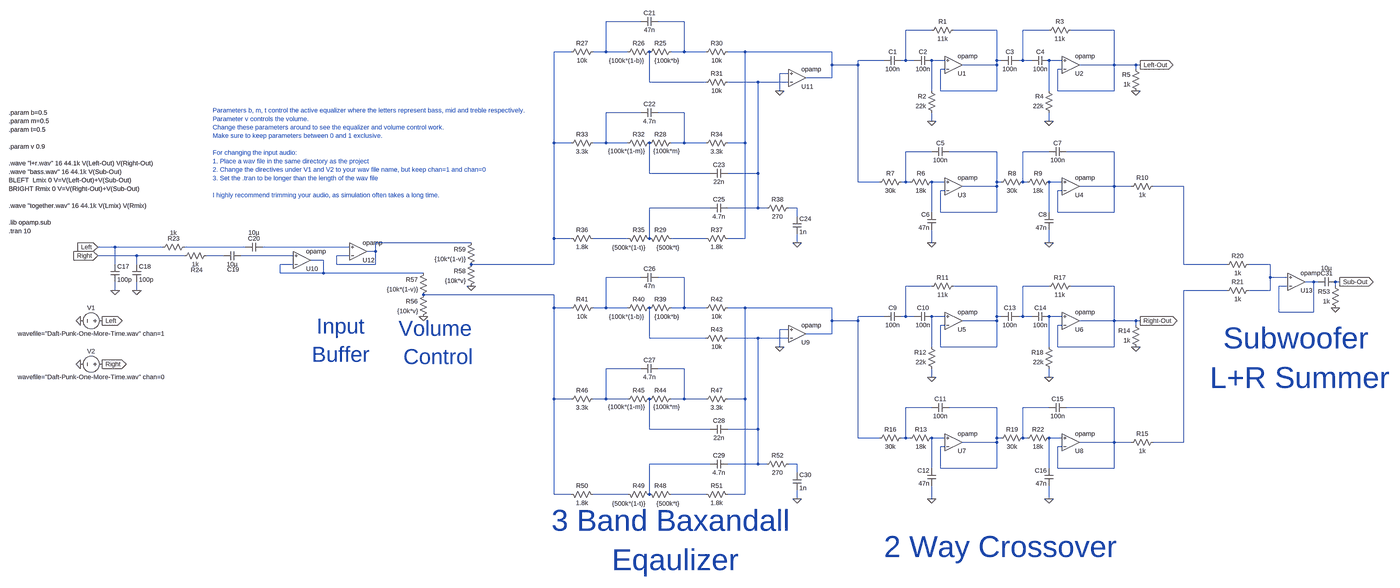
[diagram p0: schematic SoundSystemSpice.asc, whole sheet]
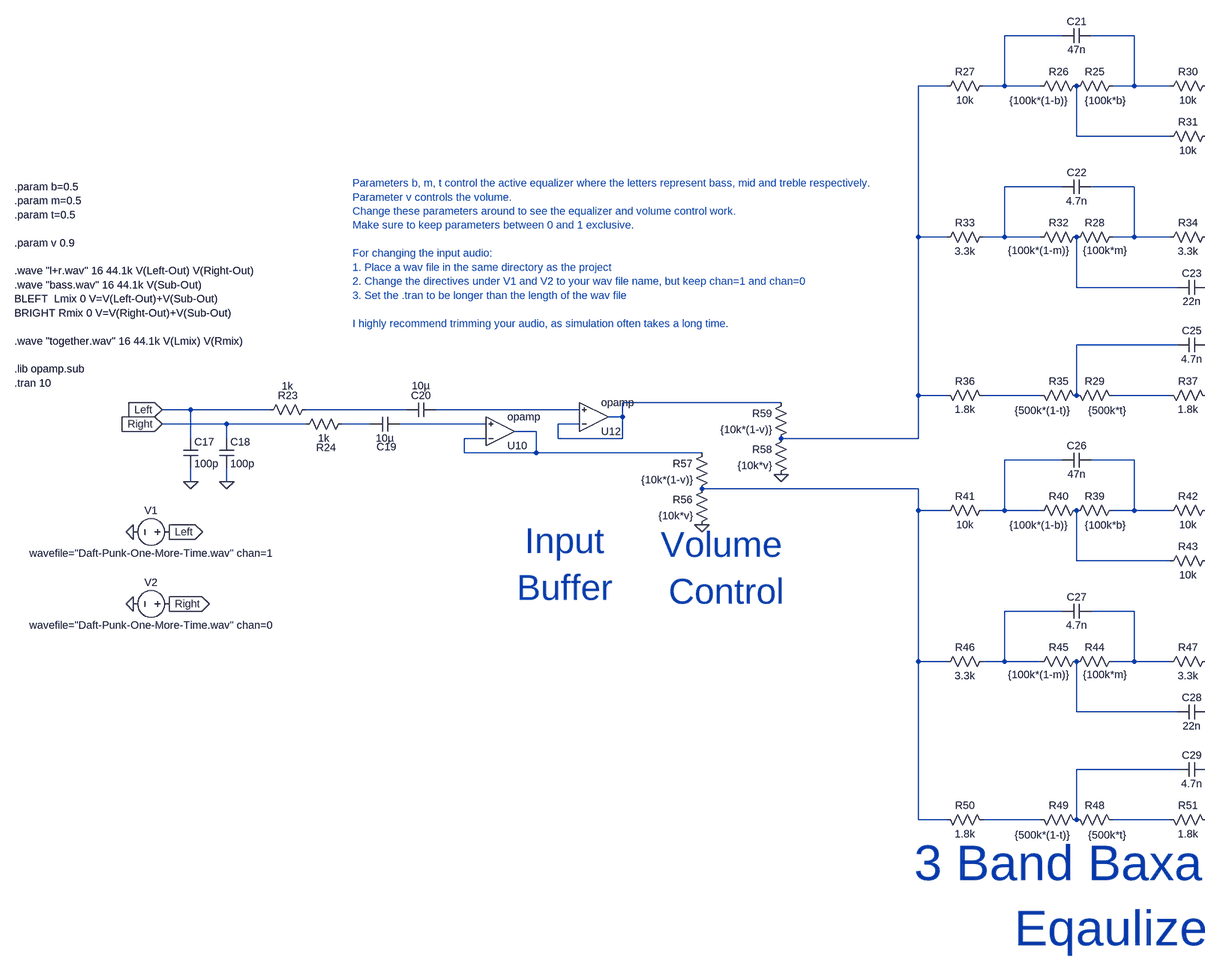
[diagram p1: schematic SoundSystemSpice.asc, part, row 1 of 1, column 1 of 2]
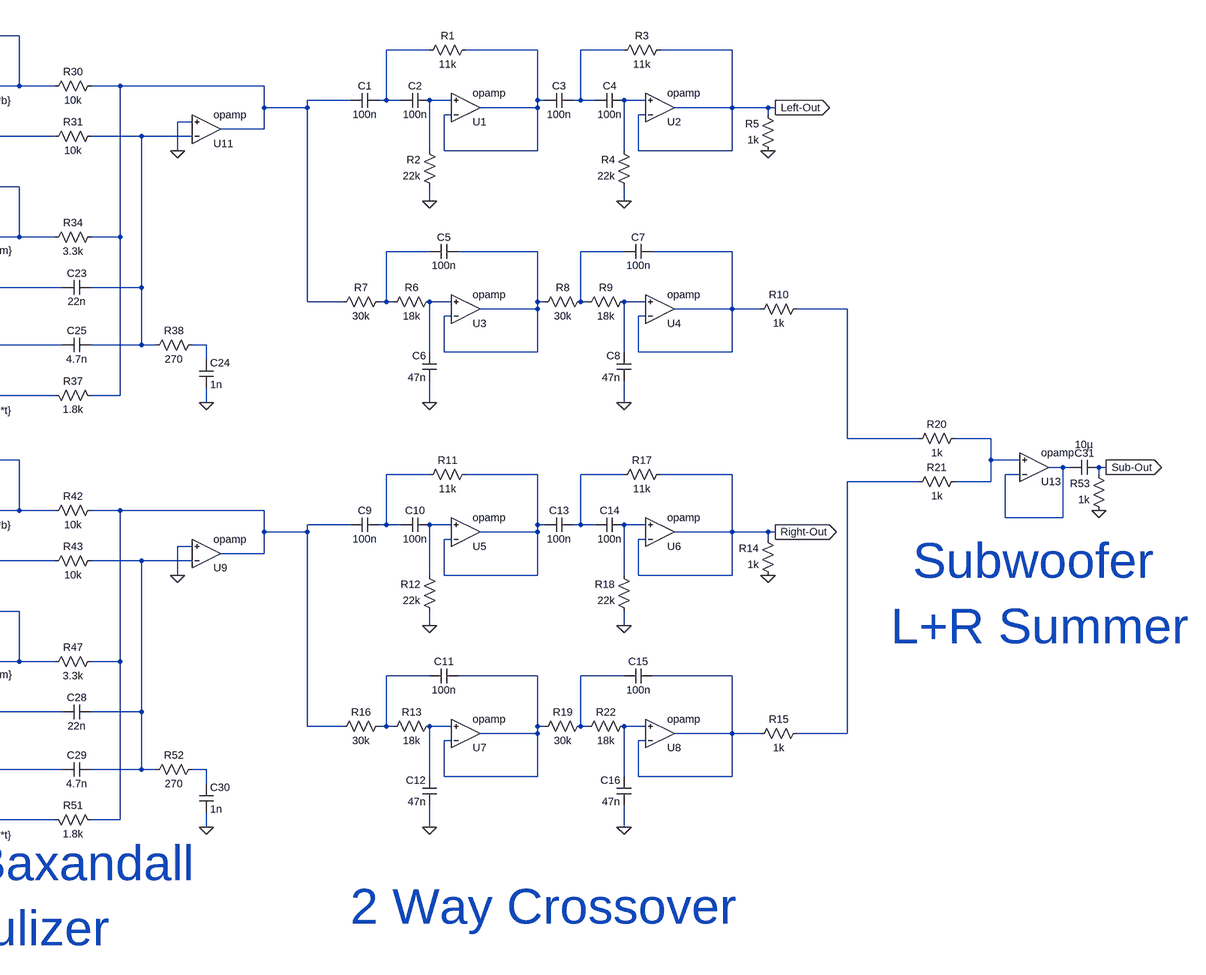
[diagram p2: schematic SoundSystemSpice.asc, part, row 1 of 1, column 2 of 2]
SoundSystemSpice.asc, the LTspice schematic file:
Version 4.1
SHEET 1 2132 1684
WIRE -864 -1056 -992 -1056
WIRE -704 -1056 -800 -1056
WIRE 208 -1024 112 -1024
WIRE 448 -1024 288 -1024
WIRE 640 -1024 544 -1024
WIRE 880 -1024 720 -1024
WIRE -1120 -944 -1184 -944
WIRE -992 -944 -992 -1056
WIRE -992 -944 -1040 -944
WIRE -912 -944 -992 -944
WIRE -704 -944 -704 -1056
WIRE -704 -944 -752 -944
WIRE -624 -944 -704 -944
WIRE -480 -944 -544 -944
WIRE -160 -944 -480 -944
WIRE 32 -912 -64 -912
WIRE 112 -912 112 -1024
WIRE 112 -912 96 -912
WIRE 144 -912 112 -912
WIRE 256 -912 208 -912
WIRE 448 -912 448 -1024
WIRE 464 -912 448 -912
WIRE 544 -912 544 -1024
WIRE 544 -912 528 -912
WIRE 576 -912 544 -912
WIRE 688 -912 640 -912
WIRE -160 -896 -160 -944
WIRE -64 -896 -64 -912
WIRE -64 -896 -160 -896
WIRE 448 -896 448 -912
WIRE 448 -896 320 -896
WIRE 880 -896 880 -1024
WIRE 880 -896 752 -896
WIRE 960 -896 880 -896
WIRE 976 -896 960 -896
WIRE 256 -880 240 -880
WIRE 688 -880 672 -880
WIRE 960 -880 960 -896
WIRE -320 -864 -352 -864
WIRE -160 -848 -160 -896
WIRE -160 -848 -256 -848
WIRE -832 -832 -832 -944
WIRE -624 -832 -832 -832
WIRE -432 -832 -544 -832
WIRE -320 -832 -432 -832
WIRE -352 -800 -352 -864
WIRE 208 -800 208 -912
WIRE 240 -800 240 -880
WIRE 448 -800 448 -896
WIRE 448 -800 240 -800
WIRE 640 -800 640 -912
WIRE 672 -800 672 -880
WIRE 880 -800 880 -896
WIRE 880 -800 672 -800
WIRE -864 -720 -992 -720
WIRE -704 -720 -800 -720
WIRE 208 -688 208 -720
WIRE 640 -688 640 -720
WIRE -1184 -608 -1184 -944
WIRE -1120 -608 -1184 -608
WIRE -992 -608 -992 -720
WIRE -992 -608 -1040 -608
WIRE -912 -608 -992 -608
WIRE -704 -608 -704 -720
WIRE -704 -608 -752 -608
WIRE -624 -608 -704 -608
WIRE -480 -608 -480 -944
WIRE -480 -608 -544 -608
WIRE 208 -576 112 -576
WIRE 448 -576 272 -576
WIRE 640 -576 544 -576
WIRE 880 -576 704 -576
WIRE -832 -496 -832 -608
WIRE -608 -496 -832 -496
WIRE -432 -496 -432 -832
WIRE -432 -496 -544 -496
WIRE -64 -464 -64 -896
WIRE 16 -464 -64 -464
WIRE 112 -464 112 -576
WIRE 112 -464 96 -464
WIRE 128 -464 112 -464
WIRE 256 -464 208 -464
WIRE 448 -464 448 -576
WIRE 464 -464 448 -464
WIRE 544 -464 544 -576
WIRE 560 -464 544 -464
WIRE 688 -464 640 -464
WIRE 448 -448 448 -464
WIRE 448 -448 320 -448
WIRE 880 -448 880 -576
WIRE 880 -448 752 -448
WIRE 944 -448 880 -448
WIRE 1136 -448 1024 -448
WIRE 256 -432 240 -432
WIRE 688 -432 672 -432
WIRE -608 -368 -832 -368
WIRE -432 -368 -432 -496
WIRE -432 -368 -544 -368
WIRE -400 -368 -432 -368
WIRE -288 -368 -320 -368
WIRE 208 -352 208 -464
WIRE 240 -352 240 -432
WIRE 448 -352 448 -448
WIRE 448 -352 240 -352
WIRE 640 -352 640 -464
WIRE 672 -352 672 -432
WIRE 880 -352 880 -448
WIRE 880 -352 672 -352
WIRE -288 -336 -288 -368
WIRE -1184 -256 -1184 -608
WIRE -1120 -256 -1184 -256
WIRE -912 -256 -1040 -256
WIRE -832 -256 -832 -368
WIRE -624 -256 -752 -256
WIRE -480 -256 -480 -608
WIRE -480 -256 -544 -256
WIRE -1584 -240 -1936 -240
WIRE -288 -240 -288 -272
WIRE 208 -240 208 -288
WIRE 640 -240 640 -288
WIRE -2896 -224 -2960 -224
WIRE -2720 -224 -2896 -224
WIRE -2416 -224 -2640 -224
WIRE -2032 -224 -2352 -224
WIRE -1936 -208 -1936 -240
WIRE -1936 -208 -1968 -208
WIRE -2816 -192 -2960 -192
WIRE -2640 -192 -2816 -192
WIRE -2496 -192 -2560 -192
WIRE -2240 -192 -2432 -192
WIRE -2032 -192 -2080 -192
WIRE -2128 -176 -2176 -176
WIRE -2896 -160 -2896 -224
WIRE -2816 -160 -2816 -192
WIRE -2240 -160 -2288 -160
WIRE -2080 -160 -2080 -192
WIRE -1936 -160 -1936 -208
WIRE -1936 -160 -2080 -160
WIRE -1184 -160 -1184 -256
WIRE -1184 -160 -1584 -160
WIRE 1136 -160 1136 -448
WIRE 1312 -160 1136 -160
WIRE 1472 -160 1392 -160
WIRE -2288 -128 -2288 -160
WIRE -2128 -128 -2128 -176
WIRE -2128 -128 -2288 -128
WIRE -1760 -128 -2128 -128
WIRE -864 -112 -992 -112
WIRE -704 -112 -800 -112
WIRE 1472 -112 1472 -160
WIRE 1536 -112 1472 -112
WIRE 1632 -96 1600 -96
WIRE 1648 -96 1632 -96
WIRE 1728 -96 1712 -96
WIRE 208 -80 112 -80
WIRE 448 -80 288 -80
WIRE 640 -80 544 -80
WIRE 880 -80 720 -80
WIRE 1536 -80 1504 -80
WIRE 1712 -80 1712 -96
WIRE -2896 -64 -2896 -96
WIRE -2816 -64 -2816 -96
WIRE 1312 -64 1136 -64
WIRE 1472 -64 1472 -112
WIRE 1472 -64 1392 -64
WIRE -1184 -48 -1760 -48
WIRE -1184 0 -1184 -48
WIRE -1120 0 -1184 0
WIRE -992 0 -992 -112
WIRE -992 0 -1040 0
WIRE -912 0 -992 0
WIRE -704 0 -704 -112
WIRE -704 0 -752 0
WIRE -624 0 -704 0
WIRE -480 0 -544 0
WIRE -160 0 -480 0
WIRE 1504 16 1504 -80
WIRE 1632 16 1632 -96
WIRE 1632 16 1504 16
WIRE 32 32 -64 32
WIRE 112 32 112 -80
WIRE 112 32 96 32
WIRE 144 32 112 32
WIRE 256 32 208 32
WIRE 448 32 448 -80
WIRE 464 32 448 32
WIRE 544 32 544 -80
WIRE 544 32 528 32
WIRE 576 32 544 32
WIRE 688 32 640 32
WIRE -160 48 -160 0
WIRE -64 48 -64 32
WIRE -64 48 -160 48
WIRE 448 48 448 32
WIRE 448 48 320 48
WIRE 880 48 880 -80
WIRE 880 48 752 48
WIRE 960 48 880 48
WIRE 976 48 960 48
WIRE 256 64 240 64
WIRE 688 64 672 64
WIRE 960 64 960 48
WIRE -320 80 -352 80
WIRE -160 96 -160 48
WIRE -160 96 -256 96
WIRE -832 112 -832 0
WIRE -624 112 -832 112
WIRE -432 112 -544 112
WIRE -320 112 -432 112
WIRE -352 144 -352 80
WIRE 208 144 208 32
WIRE 240 144 240 64
WIRE 448 144 448 48
WIRE 448 144 240 144
WIRE 640 144 640 32
WIRE 672 144 672 64
WIRE 880 144 880 48
WIRE 880 144 672 144
WIRE -864 224 -992 224
WIRE -704 224 -800 224
WIRE 208 256 208 224
WIRE 640 256 640 224
WIRE -1184 336 -1184 0
WIRE -1120 336 -1184 336
WIRE -992 336 -992 224
WIRE -992 336 -1040 336
WIRE -912 336 -992 336
WIRE -704 336 -704 224
WIRE -704 336 -752 336
WIRE -624 336 -704 336
WIRE -480 336 -480 0
WIRE -480 336 -544 336
WIRE 208 368 112 368
WIRE 448 368 272 368
WIRE 640 368 544 368
WIRE 880 368 704 368
WIRE -832 448 -832 336
WIRE -608 448 -832 448
WIRE -432 448 -432 112
WIRE -432 448 -544 448
WIRE -64 480 -64 48
WIRE 16 480 -64 480
WIRE 112 480 112 368
WIRE 112 480 96 480
WIRE 128 480 112 480
WIRE 256 480 208 480
WIRE 448 480 448 368
WIRE 464 480 448 480
WIRE 544 480 544 368
WIRE 560 480 544 480
WIRE 688 480 640 480
WIRE 448 496 448 480
WIRE 448 496 320 496
WIRE 880 496 880 368
WIRE 880 496 752 496
WIRE 944 496 880 496
WIRE 1136 496 1136 -64
WIRE 1136 496 1024 496
WIRE 256 512 240 512
WIRE 688 512 672 512
WIRE -608 576 -832 576
WIRE -432 576 -432 448
WIRE -432 576 -544 576
WIRE -400 576 -432 576
WIRE -288 576 -320 576
WIRE 208 592 208 480
WIRE 240 592 240 512
WIRE 448 592 448 496
WIRE 448 592 240 592
WIRE 640 592 640 480
WIRE 672 592 672 512
WIRE 880 592 880 496
WIRE 880 592 672 592
WIRE -288 608 -288 576
WIRE -1184 688 -1184 336
WIRE -1120 688 -1184 688
WIRE -912 688 -1040 688
WIRE -832 688 -832 576
WIRE -624 688 -752 688
WIRE -480 688 -480 336
WIRE -480 688 -544 688
WIRE -288 704 -288 672
WIRE 208 704 208 656
WIRE 640 704 640 656
FLAG 208 -688 0
FLAG 640 -688 0
FLAG 208 -240 0
FLAG 640 -240 0
FLAG 960 144 0
FLAG 960 -800 0
FLAG 1712 0 0
FLAG -2896 -64 0
FLAG -2816 -64 0
FLAG -2960 -224 Left
IOPIN -2960 -224 In
FLAG -2960 -192 Right
IOPIN -2960 -192 In
FLAG -288 -240 0
FLAG -352 -800 0
FLAG -288 704 0
FLAG -352 144 0
FLAG 976 -896 Left-Out
IOPIN 976 -896 Out
FLAG 976 48 Right-Out
IOPIN 976 48 Out
FLAG 1728 -96 Sub-Out
IOPIN 1728 -96 Out
FLAG -3024 48 0
FLAG -3024 208 0
FLAG -2944 48 Left
IOPIN -2944 48 Out
FLAG -2944 208 Right
IOPIN -2944 208 Out
FLAG -1760 32 0
FLAG -1584 -80 0
FLAG 208 256 0
FLAG 640 256 0
FLAG 208 704 0
FLAG 640 704 0
SYMBOL cap 96 -928 R90
WINDOW 0 0 32 VBottom 2
WINDOW 3 32 32 VTop 2
SYMATTR InstName C1
SYMATTR Value 100n
SYMBOL cap 208 -928 R90
WINDOW 0 0 32 VBottom 2
WINDOW 3 32 32 VTop 2
SYMATTR InstName C2
SYMATTR Value 100n
SYMBOL res 304 -1040 R90
WINDOW 0 0 56 VBottom 2
WINDOW 3 32 56 VTop 2
SYMATTR InstName R1
SYMATTR Value 11k
SYMBOL res 224 -704 R180
WINDOW 0 36 76 Left 2
WINDOW 3 36 40 Left 2
SYMATTR InstName R2
SYMATTR Value 22k
SYMBOL res 976 -784 R180
WINDOW 0 36 76 Left 2
WINDOW 3 36 40 Left 2
SYMATTR InstName R5
SYMATTR Value 1k
SYMBOL res 1040 -464 R90
WINDOW 0 0 56 VBottom 2
WINDOW 3 32 56 VTop 2
SYMATTR InstName R10
SYMATTR Value 1k
SYMBOL cap 272 -592 R90
WINDOW 0 0 32 VBottom 2
WINDOW 3 32 32 VTop 2
SYMATTR InstName C5
SYMATTR Value 100n
SYMBOL cap 224 -288 R180
WINDOW 0 24 56 Left 2
WINDOW 3 24 8 Left 2
SYMATTR InstName C6
SYMATTR Value 47n
SYMBOL res 224 -480 R90
WINDOW 0 0 56 VBottom 2
WINDOW 3 32 56 VTop 2
SYMATTR InstName R6
SYMATTR Value 18k
SYMBOL res 112 -480 R90
WINDOW 0 0 56 VBottom 2
WINDOW 3 32 56 VTop 2
SYMATTR InstName R7
SYMATTR Value 30k
SYMBOL res 976 160 R180
WINDOW 0 36 76 Left 2
WINDOW 3 36 40 Left 2
SYMATTR InstName R14
SYMATTR Value 1k
SYMBOL res 1040 480 R90
WINDOW 0 0 56 VBottom 2
WINDOW 3 32 56 VTop 2
SYMATTR InstName R15
SYMATTR Value 1k
SYMBOL res 1408 -176 R90
WINDOW 0 0 56 VBottom 2
WINDOW 3 32 56 VTop 2
SYMATTR InstName R20
SYMATTR Value 1k
SYMBOL res 1408 -80 R90
WINDOW 0 0 56 VBottom 2
WINDOW 3 32 56 VTop 2
SYMATTR InstName R21
SYMATTR Value 1k
SYMBOL cap -2912 -160 R0
SYMATTR InstName C17
SYMATTR Value 100p
SYMBOL cap -2832 -160 R0
SYMATTR InstName C18
SYMATTR Value 100p
SYMBOL res -2624 -240 R90
WINDOW 0 0 56 VBottom 2
WINDOW 3 -52 57 VTop 2
SYMATTR InstName R23
SYMATTR Value 1k
SYMBOL res -2544 -208 R90
WINDOW 0 84 51 VBottom 2
WINDOW 3 32 56 VTop 2
SYMATTR InstName R24
SYMATTR Value 1k
SYMBOL cap -2432 -208 R90
WINDOW 0 82 29 VBottom 2
WINDOW 3 32 32 VTop 2
SYMATTR InstName C19
SYMATTR Value 10µ
SYMBOL cap -2352 -240 R90
WINDOW 0 0 32 VBottom 2
WINDOW 3 -53 32 VTop 2
SYMATTR InstName C20
SYMATTR Value 10µ
SYMBOL OpAmps\\opamp 288 -832 M180
SYMATTR InstName U1
SYMBOL OpAmps\\opamp 720 -832 M180
SYMATTR InstName U2
SYMBOL OpAmps\\opamp 288 -384 M180
SYMATTR InstName U3
SYMBOL OpAmps\\opamp 720 -384 M180
SYMATTR InstName U4
SYMBOL OpAmps\\opamp -2208 -112 M180
SYMATTR InstName U10
SYMBOL res -848 -928 R270
WINDOW 0 32 56 VTop 2
WINDOW 3 -1 80 VBottom 2
SYMATTR InstName R25
SYMATTR Value {100k*b}
SYMBOL res -928 -928 R270
WINDOW 0 32 56 VTop 2
WINDOW 3 -1 12 VBottom 2
SYMATTR InstName R26
SYMATTR Value {100k*(1-b)}
SYMBOL res -1024 -960 R90
WINDOW 0 0 56 VBottom 2
WINDOW 3 32 56 VTop 2
SYMATTR InstName R27
SYMATTR Value 10k
SYMBOL cap -800 -1072 R90
WINDOW 0 0 32 VBottom 2
WINDOW 3 32 32 VTop 2
SYMATTR InstName C21
SYMATTR Value 47n
SYMBOL res -528 -960 R90
WINDOW 0 0 56 VBottom 2
WINDOW 3 32 56 VTop 2
SYMATTR InstName R30
SYMATTR Value 10k
SYMBOL res -528 -848 R90
WINDOW 0 0 56 VBottom 2
WINDOW 3 32 56 VTop 2
SYMATTR InstName R31
SYMATTR Value 10k
SYMBOL res -848 -592 R270
WINDOW 0 32 56 VTop 2
WINDOW 3 2 79 VBottom 2
SYMATTR InstName R28
SYMATTR Value {100k*m}
SYMBOL res -928 -592 R270
WINDOW 0 32 56 VTop 2
WINDOW 3 2 12 VBottom 2
SYMATTR InstName R32
SYMATTR Value {100k*(1-m)}
SYMBOL res -1024 -624 R90
WINDOW 0 0 56 VBottom 2
WINDOW 3 32 56 VTop 2
SYMATTR InstName R33
SYMATTR Value 3.3k
SYMBOL cap -800 -736 R90
WINDOW 0 0 32 VBottom 2
WINDOW 3 32 32 VTop 2
SYMATTR InstName C22
SYMATTR Value 4.7n
SYMBOL res -528 -624 R90
WINDOW 0 0 56 VBottom 2
WINDOW 3 32 56 VTop 2
SYMATTR InstName R34
SYMATTR Value 3.3k
SYMBOL cap -544 -512 R90
WINDOW 0 0 32 VBottom 2
WINDOW 3 32 32 VTop 2
SYMATTR InstName C23
SYMATTR Value 22n
SYMBOL res -848 -272 M90
WINDOW 0 0 56 VBottom 2
WINDOW 3 34 84 VTop 2
SYMATTR InstName R29
SYMATTR Value {500k*t}
SYMBOL res -928 -272 M90
WINDOW 0 0 56 VBottom 2
WINDOW 3 34 20 VTop 2
SYMATTR InstName R35
SYMATTR Value {500k*(1-t)}
SYMBOL res -1024 -240 M270
WINDOW 0 32 56 VTop 2
WINDOW 3 0 56 VBottom 2
SYMATTR InstName R36
SYMATTR Value 1.8k
SYMBOL res -528 -240 M270
WINDOW 0 32 56 VTop 2
WINDOW 3 0 56 VBottom 2
SYMATTR InstName R37
SYMATTR Value 1.8k
SYMBOL cap -544 -352 M270
WINDOW 0 32 32 VTop 2
WINDOW 3 0 32 VBottom 2
SYMATTR InstName C25
SYMATTR Value 4.7n
SYMBOL res -304 -384 R90
WINDOW 0 0 56 VBottom 2
WINDOW 3 32 56 VTop 2
SYMATTR InstName R38
SYMATTR Value 270
SYMBOL cap -304 -336 R0
SYMATTR InstName C24
SYMATTR Value 1n
SYMBOL OpAmps\\opamp -288 -784 M180
SYMATTR InstName U11
SYMBOL res -848 16 R270
WINDOW 0 32 56 VTop 2
WINDOW 3 -1 80 VBottom 2
SYMATTR InstName R39
SYMATTR Value {100k*b}
SYMBOL res -928 16 R270
WINDOW 0 32 56 VTop 2
WINDOW 3 -1 12 VBottom 2
SYMATTR InstName R40
SYMATTR Value {100k*(1-b)}
SYMBOL res -1024 -16 R90
WINDOW 0 0 56 VBottom 2
WINDOW 3 32 56 VTop 2
SYMATTR InstName R41
SYMATTR Value 10k
SYMBOL cap -800 -128 R90
WINDOW 0 0 32 VBottom 2
WINDOW 3 32 32 VTop 2
SYMATTR InstName C26
SYMATTR Value 47n
SYMBOL res -528 -16 R90
WINDOW 0 0 56 VBottom 2
WINDOW 3 32 56 VTop 2
SYMATTR InstName R42
SYMATTR Value 10k
SYMBOL res -528 96 R90
WINDOW 0 0 56 VBottom 2
WINDOW 3 32 56 VTop 2
SYMATTR InstName R43
SYMATTR Value 10k
SYMBOL res -848 352 R270
WINDOW 0 32 56 VTop 2
WINDOW 3 2 79 VBottom 2
SYMATTR InstName R44
SYMATTR Value {100k*m}
SYMBOL res -928 352 R270
WINDOW 0 32 56 VTop 2
WINDOW 3 2 12 VBottom 2
SYMATTR InstName R45
SYMATTR Value {100k*(1-m)}
SYMBOL res -1024 320 R90
WINDOW 0 0 56 VBottom 2
WINDOW 3 32 56 VTop 2
SYMATTR InstName R46
SYMATTR Value 3.3k
SYMBOL cap -800 208 R90
WINDOW 0 0 32 VBottom 2
WINDOW 3 32 32 VTop 2
SYMATTR InstName C27
SYMATTR Value 4.7n
SYMBOL res -528 320 R90
WINDOW 0 0 56 VBottom 2
WINDOW 3 32 56 VTop 2
SYMATTR InstName R47
SYMATTR Value 3.3k
SYMBOL cap -544 432 R90
WINDOW 0 0 32 VBottom 2
WINDOW 3 32 32 VTop 2
SYMATTR InstName C28
SYMATTR Value 22n
SYMBOL res -848 672 M90
WINDOW 0 0 56 VBottom 2
WINDOW 3 34 84 VTop 2
SYMATTR InstName R48
SYMATTR Value {500k*t}
SYMBOL res -928 672 M90
WINDOW 0 0 56 VBottom 2
WINDOW 3 34 20 VTop 2
SYMATTR InstName R49
SYMATTR Value {500k*(1-t)}
SYMBOL res -1024 704 M270
WINDOW 0 32 56 VTop 2
WINDOW 3 0 56 VBottom 2
SYMATTR InstName R50
SYMATTR Value 1.8k
SYMBOL res -528 704 M270
WINDOW 0 32 56 VTop 2
WINDOW 3 0 56 VBottom 2
SYMATTR InstName R51
SYMATTR Value 1.8k
SYMBOL cap -544 592 M270
WINDOW 0 32 32 VTop 2
WINDOW 3 0 32 VBottom 2
SYMATTR InstName C29
SYMATTR Value 4.7n
SYMBOL res -304 560 R90
WINDOW 0 0 56 VBottom 2
WINDOW 3 32 56 VTop 2
SYMATTR InstName R52
SYMATTR Value 270
SYMBOL cap -304 608 R0
SYMATTR InstName C30
SYMATTR Value 1n
SYMBOL OpAmps\\opamp -288 160 M180
SYMATTR InstName U9
SYMBOL voltage -2928 48 R90
WINDOW 0 -32 56 VBottom 2
WINDOW 3 32 56 VTop 2
SYMATTR InstName V1
SYMATTR Value wavefile="Daft-Punk-One-More-Time.wav" chan=1
SYMBOL voltage -2928 208 R90
WINDOW 0 -32 56 VBottom 2
WINDOW 3 32 56 VTop 2
SYMATTR InstName V2
SYMATTR Value wavefile="Daft-Punk-One-More-Time.wav" chan=0
SYMBOL OpAmps\\opamp -2000 -144 M180
SYMATTR InstName U12
SYMBOL OpAmps\\opamp 1568 -32 M180
SYMATTR InstName U13
SYMBOL res 1728 16 R180
WINDOW 0 36 76 Left 2
WINDOW 3 36 40 Left 2
SYMATTR InstName R53
SYMATTR Value 1k
SYMBOL res -1744 -64 M0
SYMATTR InstName R56
SYMATTR Value {10k*v}
SYMBOL res -1744 -144 M0
SYMATTR InstName R57
SYMATTR Value {10k*(1-v)}
SYMBOL res -1568 -176 M0
SYMATTR InstName R58
SYMATTR Value {10k*v}
SYMBOL res -1568 -256 M0
SYMATTR InstName R59
SYMATTR Value {10k*(1-v)}
SYMBOL cap 1648 -112 M90
WINDOW 0 0 32 VBottom 2
WINDOW 3 -50 31 VTop 2
SYMATTR InstName C31
SYMATTR Value 10µ
SYMBOL cap 528 -928 R90
WINDOW 0 0 32 VBottom 2
WINDOW 3 32 32 VTop 2
SYMATTR InstName C3
SYMATTR Value 100n
SYMBOL cap 640 -928 R90
WINDOW 0 0 32 VBottom 2
WINDOW 3 32 32 VTop 2
SYMATTR InstName C4
SYMATTR Value 100n
SYMBOL res 736 -1040 R90
WINDOW 0 0 56 VBottom 2
WINDOW 3 32 56 VTop 2
SYMATTR InstName R3
SYMATTR Value 11k
SYMBOL res 656 -704 R180
WINDOW 0 36 76 Left 2
WINDOW 3 36 40 Left 2
SYMATTR InstName R4
SYMATTR Value 22k
SYMBOL cap 704 -592 R90
WINDOW 0 0 32 VBottom 2
WINDOW 3 32 32 VTop 2
SYMATTR InstName C7
SYMATTR Value 100n
SYMBOL cap 656 -288 R180
WINDOW 0 24 56 Left 2
WINDOW 3 24 8 Left 2
SYMATTR InstName C8
SYMATTR Value 47n
SYMBOL res 560 -480 R90
WINDOW 0 0 56 VBottom 2
WINDOW 3 32 56 VTop 2
SYMATTR InstName R8
SYMATTR Value 30k
SYMBOL res 656 -480 R90
WINDOW 0 0 56 VBottom 2
WINDOW 3 32 56 VTop 2
SYMATTR InstName R9
SYMATTR Value 18k
SYMBOL cap 96 16 R90
WINDOW 0 0 32 VBottom 2
WINDOW 3 32 32 VTop 2
SYMATTR InstName C9
SYMATTR Value 100n
SYMBOL cap 208 16 R90
WINDOW 0 0 32 VBottom 2
WINDOW 3 32 32 VTop 2
SYMATTR InstName C10
SYMATTR Value 100n
SYMBOL res 304 -96 R90
WINDOW 0 0 56 VBottom 2
WINDOW 3 32 56 VTop 2
SYMATTR InstName R11
SYMATTR Value 11k
SYMBOL res 224 240 R180
WINDOW 0 36 76 Left 2
WINDOW 3 36 40 Left 2
SYMATTR InstName R12
SYMATTR Value 22k
SYMBOL cap 272 352 R90
WINDOW 0 0 32 VBottom 2
WINDOW 3 32 32 VTop 2
SYMATTR InstName C11
SYMATTR Value 100n
SYMBOL cap 224 656 R180
WINDOW 0 24 56 Left 2
WINDOW 3 24 8 Left 2
SYMATTR InstName C12
SYMATTR Value 47n
SYMBOL res 224 464 R90
WINDOW 0 0 56 VBottom 2
WINDOW 3 32 56 VTop 2
SYMATTR InstName R13
SYMATTR Value 18k
SYMBOL res 112 464 R90
WINDOW 0 0 56 VBottom 2
WINDOW 3 32 56 VTop 2
SYMATTR InstName R16
SYMATTR Value 30k
SYMBOL OpAmps\\opamp 288 112 M180
SYMATTR InstName U5
SYMBOL OpAmps\\opamp 720 112 M180
SYMATTR InstName U6
SYMBOL OpAmps\\opamp 288 560 M180
SYMATTR InstName U7
SYMBOL OpAmps\\opamp 720 560 M180
SYMATTR InstName U8
SYMBOL cap 528 16 R90
WINDOW 0 0 32 VBottom 2
WINDOW 3 32 32 VTop 2
SYMATTR InstName C13
SYMATTR Value 100n
SYMBOL cap 640 16 R90
WINDOW 0 0 32 VBottom 2
WINDOW 3 32 32 VTop 2
SYMATTR InstName C14
SYMATTR Value 100n
SYMBOL res 736 -96 R90
WINDOW 0 0 56 VBottom 2
WINDOW 3 32 56 VTop 2
SYMATTR InstName R17
SYMATTR Value 11k
SYMBOL res 656 240 R180
WINDOW 0 36 76 Left 2
WINDOW 3 36 40 Left 2
SYMATTR InstName R18
SYMATTR Value 22k
SYMBOL cap 704 352 R90
WINDOW 0 0 32 VBottom 2
WINDOW 3 32 32 VTop 2
SYMATTR InstName C15
SYMATTR Value 100n
SYMBOL cap 656 656 R180
WINDOW 0 24 56 Left 2
WINDOW 3 24 8 Left 2
SYMATTR InstName C16
SYMATTR Value 47n
SYMBOL res 560 464 R90
WINDOW 0 0 56 VBottom 2
WINDOW 3 32 56 VTop 2
SYMATTR InstName R19
SYMATTR Value 30k
SYMBOL res 656 464 R90
WINDOW 0 0 56 VBottom 2
WINDOW 3 32 56 VTop 2
SYMATTR InstName R22
SYMATTR Value 18k
TEXT -3288 -720 Left 2 !.param b=0.5\n.param m=0.5\n.param t=0.5\n \n.param v 0.9\n \n.wave "l+r.wav" 16 44.1k V(Left-Out) V(Right-Out)\n.wave "bass.wav" 16 44.1k V(Sub-Out) \nBLEFT  Lmix 0 V=V(Left-Out)+V(Sub-Out)\nBRIGHT Rmix 0 V=V(Right-Out)+V(Sub-Out)\n \n.wave "together.wav" 16 44.1k V(Lmix) V(Rmix)\n \n.lib opamp.sub\n.tran 10
TEXT -2536 -728 Left 2 ;Parameters b, m, t control the active equalizer where the letters represent bass, mid and treble respectively.\nParameter v controls the volume.\nChange these parameters around to see the equalizer and volume control work.\nMake sure to keep parameters between 0 and 1 exclusive.\n \nFor changing the input audio: \n1. Place a wav file in the same directory as the project\n2. Change the directives under V1 and V2 to your wav file name, but keep chan=1 and chan=0\n3. Set the .tran to be longer than the length of the wav file\n \nI highly recommend trimming your audio, as simulation often takes a long time.
TEXT -736 856 Center 7 ;3 Band Baxandall \nEqaulizer
TEXT 464 880 Center 7 ;2 Way Crossover
TEXT 1584 184 Center 7 ;Subwoofer \nL+R Summer
TEXT -1704 128 Center 6 ;Volume \nControl
TEXT -2064 120 Center 6 ;Input\nBuffer

The netlist it stands for:
* SoundSystemSpice.asc
C1 N003 N007 100n
C2 N008 N003 100n
R1 N004 N003 11k
R2 0 N008 22k
R5 0 Left-Out 1k
R10 N021 N017 1k
C5 N015 N014 100n
C6 0 N019 47n
R6 N019 N014 18k
R7 N014 N007 30k
R14 0 Right-Out 1k
R15 N039 N051 1k
R20 N032 N021 1k
R21 N032 N039 1k
C17 Left 0 100p
C18 Right 0 100p
R23 N027 Left 1k
R24 N029 Right 1k
C19 N030 N029 10µ
C20 N028 N027 10µ
X§U1 N004 N008 N004 opamp Aol=100K GBW=10Meg  ; pins invin noninvin out
X§U2 Left-Out N009 Left-Out opamp Aol=100K GBW=10Meg  ; pins invin noninvin out
X§U3 N015 N019 N015 opamp Aol=100K GBW=10Meg  ; pins invin noninvin out
X§U4 N017 N020 N017 opamp Aol=100K GBW=10Meg  ; pins invin noninvin out
X§U10 N031 N030 N031 opamp Aol=100K GBW=10Meg  ; pins invin noninvin out
R25 N010 N002 {100k*b}
R26 N001 N010 {100k*(1-b)}
R27 N001 N006 10k
C21 N002 N001 47n
R30 N007 N002 10k
R31 N011 N010 10k
R28 N018 N013 {100k*m}
R32 N012 N018 {100k*(1-m)}
R33 N012 N006 3.3k
C22 N013 N012 4.7n
R34 N007 N013 3.3k
C23 N011 N018 22n
R29 N022 N025 {500k*t}
R35 N024 N022 {500k*(1-t)}
R36 N024 N006 1.8k
R37 N007 N025 1.8k
C25 N011 N022 4.7n
R38 N023 N011 270
C24 N023 0 1n
X§U11 N011 0 N007 opamp Aol=100K GBW=10Meg  ; pins invin noninvin out
R39 N044 N034 {100k*b}
R40 N033 N044 {100k*(1-b)}
R41 N033 N040 10k
C26 N034 N033 47n
R42 N041 N034 10k
R43 N045 N044 10k
R44 N052 N047 {100k*m}
R45 N046 N052 {100k*(1-m)}
R46 N046 N040 3.3k
C27 N047 N046 4.7n
R47 N041 N047 3.3k
C28 N045 N052 22n
R48 N055 N058 {500k*t}
R49 N057 N055 {500k*(1-t)}
R50 N057 N040 1.8k
R51 N041 N058 1.8k
C29 N045 N055 4.7n
R52 N056 N045 270
C30 N056 0 1n
X§U9 N045 0 N041 opamp Aol=100K GBW=10Meg  ; pins invin noninvin out
V1 Left 0 wavefile="Daft-Punk-One-More-Time.wav" chan=1
V2 Right 0 wavefile="Daft-Punk-One-More-Time.wav" chan=0
X§U12 N026 N028 N026 opamp Aol=100K GBW=10Meg  ; pins invin noninvin out
X§U13 N035 N032 N035 opamp Aol=100K GBW=10Meg  ; pins invin noninvin out
R53 0 Sub-Out 1k
R56 N040 0 {10k*v}
R57 N031 N040 {10k*(1-v)}
R58 N006 0 {10k*v}
R59 N026 N006 {10k*(1-v)}
C31 N035 Sub-Out 10µ
C3 N005 N004 100n
C4 N009 N005 100n
R3 Left-Out N005 11k
R4 0 N009 22k
C7 N017 N016 100n
C8 0 N020 47n
R8 N016 N015 30k
R9 N020 N016 18k
C9 N036 N041 100n
C10 N042 N036 100n
R11 N037 N036 11k
R12 0 N042 22k
C11 N049 N048 100n
C12 0 N053 47n
R13 N053 N048 18k
R16 N048 N041 30k
X§U5 N037 N042 N037 opamp Aol=100K GBW=10Meg  ; pins invin noninvin out
X§U6 Right-Out N043 Right-Out opamp Aol=100K GBW=10Meg  ; pins invin noninvin out
X§U7 N049 N053 N049 opamp Aol=100K GBW=10Meg  ; pins invin noninvin out
X§U8 N051 N054 N051 opamp Aol=100K GBW=10Meg  ; pins invin noninvin out
C13 N038 N037 100n
C14 N043 N038 100n
R17 Right-Out N038 11k
R18 0 N043 22k
C15 N051 N050 100n
C16 0 N054 47n
R19 N050 N049 30k
R22 N054 N050 18k
.param b=0.5
.param m=0.5
.param t=0.5
.param v 0.9
.wave "l+r.wav" 16 44.1k V(Left-Out) V(Right-Out)
.wave "bass.wav" 16 44.1k V(Sub-Out)
BLEFT  Lmix 0 V=V(Left-Out)+V(Sub-Out)
BRIGHT Rmix 0 V=V(Right-Out)+V(Sub-Out)
.wave "together.wav" 16 44.1k V(Lmix) V(Rmix)
.lib opamp.sub
.tran 10
* Parameters b, m, t control the active equalizer where the letters represent bass, mid and treble respectively.
* Parameter v controls the volume.
* Change these parameters around to see the equalizer and volume control work.
* Make sure to keep parameters between 0 and 1 exclusive.
* For changing the input audio:
* 1. Place a wav file in the same directory as the project
* 2. Change the directives under V1 and V2 to your wav file name, but keep chan=1 and chan=0
* 3. Set the .tran to be longer than the length of the wav file
* I highly recommend trimming your audio, as simulation often takes a long time.
* 3 Band Baxandall
* Eqaulizer
* 2 Way Crossover
* Subwoofer
* L+R Summer
* Volume
* Control
* Input
* Buffer
.backanno
.end